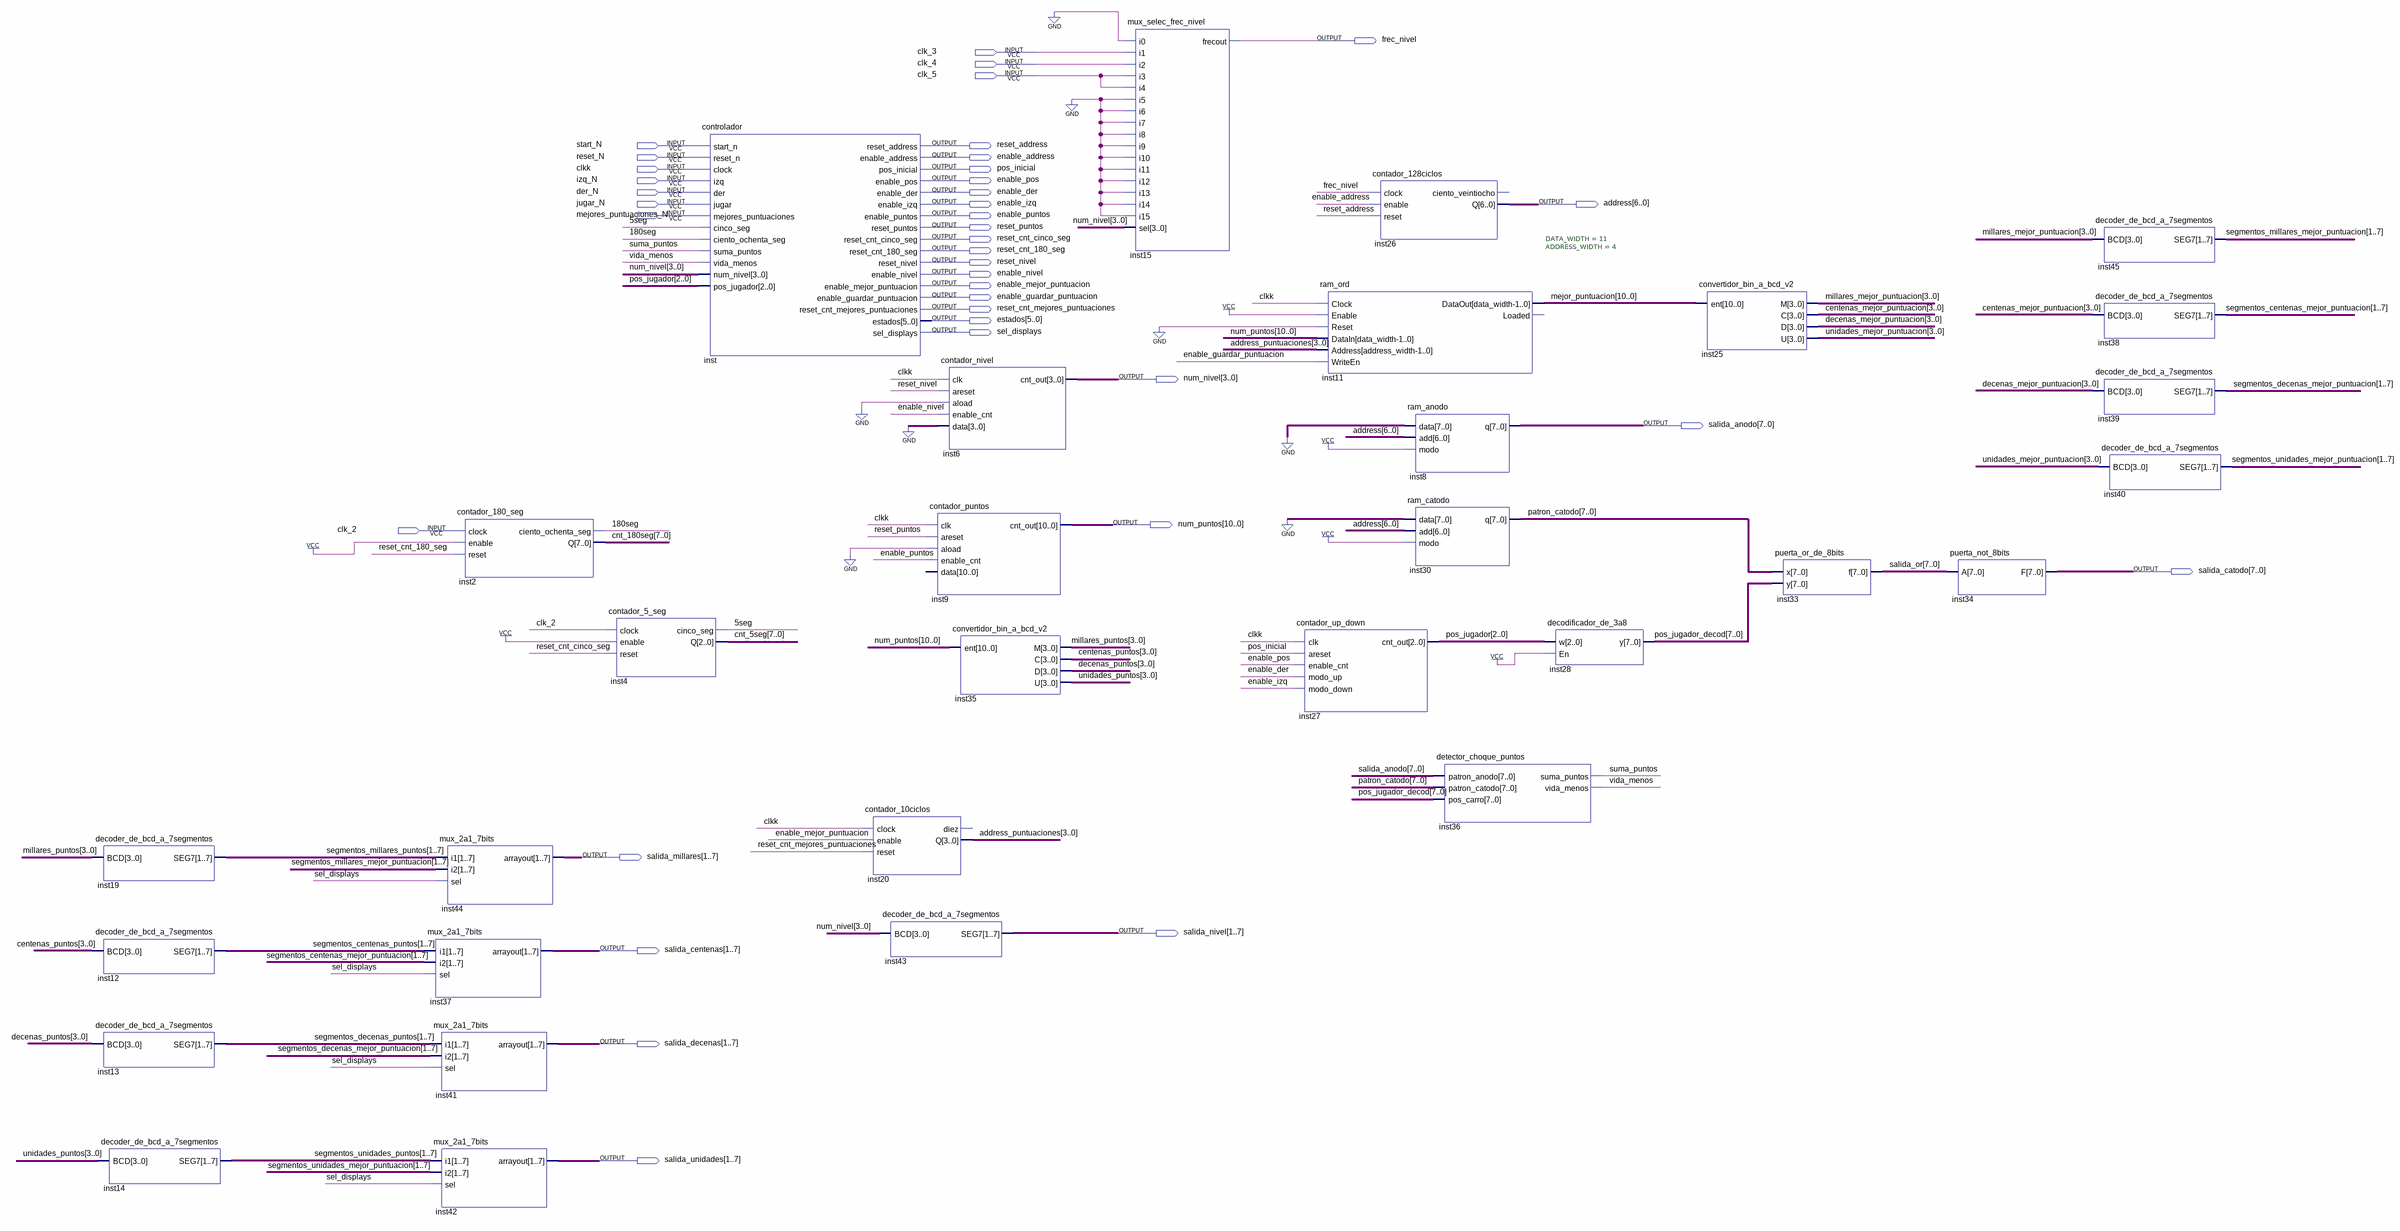
[diagram p0: schematic sheet]
// Quartus schematic simulate.bdf as structural Verilog: 31 symbols, 39 pins
module simulate (
  input  clk_3,
  input  clk_4,
  input  clk_5,
  input  start_N,
  input  reset_N,
  input  clkk,
  input  izq_N,
  input  der_N,
  input  jugar_N,
  input  mejores_puntuaciones_N,
  input  clk_2,
  output frec_nivel,
  output reset_address,
  output enable_address,
  output pos_inicial,
  output enable_pos,
  output enable_der,
  output enable_izq,
  output [6:0] address,
  output enable_puntos,
  output reset_puntos,
  output reset_cnt_cinco_seg,
  output reset_cnt_180_seg,
  output reset_nivel,
  output enable_nivel,
  output enable_mejor_puntuacion,
  output enable_guardar_puntuacion,
  output reset_cnt_mejores_puntuaciones,
  output [5:0] estados,
  output sel_displays,
  output [3:0] num_nivel,
  output [7:0] salida_anodo,
  output [10:0] num_puntos,
  output [7:0] salida_catodo,
  output [1:7] salida_millares,
  output [1:7] salida_nivel,
  output [1:7] salida_centenas,
  output [1:7] salida_decenas,
  output [1:7] salida_unidades
);

  wire \5seg , \180seg , suma_puntos, vida_menos;
  wire [2:0] pos_jugador;
  wire [3:0] address_puntuaciones, centenas_mejor_puntuacion, centenas_puntos, decenas_mejor_puntuacion,
       decenas_puntos, millares_mejor_puntuacion, millares_puntos, unidades_mejor_puntuacion, unidades_puntos;
  wire [7:0] cnt_5seg, cnt_180seg, patron_catodo, pos_jugador_decod, salida_or;
  wire [7:1] segmentos_centenas_mejor_puntuacion, segmentos_centenas_puntos,
       segmentos_decenas_mejor_puntuacion, segmentos_decenas_puntos, segmentos_millares_mejor_puntuacion,
       segmentos_millares_puntos, segmentos_unidades_mejor_puntuacion, segmentos_unidades_puntos;
  wire [10:0] mejor_puntuacion;

  decoder_de_bcd_a_7segmentos inst19 (
    .BCD(millares_puntos),
    .SEG7({segmentos_millares_puntos[1], segmentos_millares_puntos[2], segmentos_millares_puntos[3], segmentos_millares_puntos[4], segmentos_millares_puntos[5], segmentos_millares_puntos[6], segmentos_millares_puntos[7]}));
  decoder_de_bcd_a_7segmentos inst12 (
    .BCD(centenas_puntos),
    .SEG7({segmentos_centenas_puntos[1], segmentos_centenas_puntos[2], segmentos_centenas_puntos[3], segmentos_centenas_puntos[4], segmentos_centenas_puntos[5], segmentos_centenas_puntos[6], segmentos_centenas_puntos[7]}));
  decoder_de_bcd_a_7segmentos inst13 (
    .BCD(decenas_puntos),
    .SEG7({segmentos_decenas_puntos[1], segmentos_decenas_puntos[2], segmentos_decenas_puntos[3], segmentos_decenas_puntos[4], segmentos_decenas_puntos[5], segmentos_decenas_puntos[6], segmentos_decenas_puntos[7]}));
  decoder_de_bcd_a_7segmentos inst14 (
    .BCD(unidades_puntos),
    .SEG7({segmentos_unidades_puntos[1], segmentos_unidades_puntos[2], segmentos_unidades_puntos[3], segmentos_unidades_puntos[4], segmentos_unidades_puntos[5], segmentos_unidades_puntos[6], segmentos_unidades_puntos[7]}));
  mux_2a1_7bits inst44 (
    .i1({segmentos_millares_puntos[1], segmentos_millares_puntos[2], segmentos_millares_puntos[3], segmentos_millares_puntos[4], segmentos_millares_puntos[5], segmentos_millares_puntos[6], segmentos_millares_puntos[7]}),
    .i2({segmentos_millares_mejor_puntuacion[1], segmentos_millares_mejor_puntuacion[2], segmentos_millares_mejor_puntuacion[3], segmentos_millares_mejor_puntuacion[4], segmentos_millares_mejor_puntuacion[5], segmentos_millares_mejor_puntuacion[6], segmentos_millares_mejor_puntuacion[7]}),
    .sel(sel_displays), .arrayout(salida_millares));
  mux_2a1_7bits inst37 (
    .i1({segmentos_centenas_puntos[1], segmentos_centenas_puntos[2], segmentos_centenas_puntos[3], segmentos_centenas_puntos[4], segmentos_centenas_puntos[5], segmentos_centenas_puntos[6], segmentos_centenas_puntos[7]}),
    .i2({segmentos_centenas_mejor_puntuacion[1], segmentos_centenas_mejor_puntuacion[2], segmentos_centenas_mejor_puntuacion[3], segmentos_centenas_mejor_puntuacion[4], segmentos_centenas_mejor_puntuacion[5], segmentos_centenas_mejor_puntuacion[6], segmentos_centenas_mejor_puntuacion[7]}),
    .sel(sel_displays), .arrayout(salida_centenas));
  mux_2a1_7bits inst41 (
    .i1({segmentos_decenas_puntos[1], segmentos_decenas_puntos[2], segmentos_decenas_puntos[3], segmentos_decenas_puntos[4], segmentos_decenas_puntos[5], segmentos_decenas_puntos[6], segmentos_decenas_puntos[7]}),
    .i2({segmentos_decenas_mejor_puntuacion[1], segmentos_decenas_mejor_puntuacion[2], segmentos_decenas_mejor_puntuacion[3], segmentos_decenas_mejor_puntuacion[4], segmentos_decenas_mejor_puntuacion[5], segmentos_decenas_mejor_puntuacion[6], segmentos_decenas_mejor_puntuacion[7]}),
    .sel(sel_displays), .arrayout(salida_decenas));
  mux_2a1_7bits inst42 (
    .i1({segmentos_unidades_puntos[1], segmentos_unidades_puntos[2], segmentos_unidades_puntos[3], segmentos_unidades_puntos[4], segmentos_unidades_puntos[5], segmentos_unidades_puntos[6], segmentos_unidades_puntos[7]}),
    .i2({segmentos_unidades_mejor_puntuacion[1], segmentos_unidades_mejor_puntuacion[2], segmentos_unidades_mejor_puntuacion[3], segmentos_unidades_mejor_puntuacion[4], segmentos_unidades_mejor_puntuacion[5], segmentos_unidades_mejor_puntuacion[6], segmentos_unidades_mejor_puntuacion[7]}),
    .sel(sel_displays), .arrayout(salida_unidades));
  contador_180_seg inst2 (
    .enable(1'b1), .reset(reset_cnt_180_seg), .ciento_ochenta_seg(\180seg ), .Q(cnt_180seg));  // open: clock
  contador_5_seg inst4 (.clock(clk_2), .enable(1'b1), .reset(reset_cnt_cinco_seg), .cinco_seg(\5seg ), .Q(cnt_5seg));
  controlador inst (
    .start_n(start_N), .reset_n(reset_N), .clock(clkk), .izq(izq_N), .der(der_N), .jugar(jugar_N),
    .mejores_puntuaciones(mejores_puntuaciones_N), .cinco_seg(\5seg ), .ciento_ochenta_seg(\180seg ),
    .suma_puntos(suma_puntos), .vida_menos(vida_menos), .num_nivel(num_nivel), .pos_jugador(pos_jugador),
    .reset_address(reset_address), .enable_address(enable_address), .pos_inicial(pos_inicial),
    .enable_pos(enable_pos), .enable_der(enable_der), .enable_izq(enable_izq), .enable_puntos(enable_puntos),
    .reset_puntos(reset_puntos), .reset_cnt_cinco_seg(reset_cnt_cinco_seg),
    .reset_cnt_180_seg(reset_cnt_180_seg), .reset_nivel(reset_nivel), .enable_nivel(enable_nivel),
    .enable_mejor_puntuacion(enable_mejor_puntuacion), .enable_guardar_puntuacion(enable_guardar_puntuacion),
    .reset_cnt_mejores_puntuaciones(reset_cnt_mejores_puntuaciones), .estados(estados),
    .sel_displays(sel_displays));
  contador_10ciclos inst20 (
    .clock(clkk), .enable(enable_mejor_puntuacion), .reset(reset_cnt_mejores_puntuaciones),
    .Q(address_puntuaciones));  // open: diez
  decoder_de_bcd_a_7segmentos inst43 (.BCD(num_nivel), .SEG7(salida_nivel));
  contador_nivel inst6 (
    .clk(clkk), .areset(reset_nivel), .aload(1'b0), .enable_cnt(enable_nivel), .data(4'b0000),
    .cnt_out(num_nivel));
  contador_puntos inst9 (
    .clk(clkk), .areset(reset_puntos), .aload(1'b0), .enable_cnt(enable_puntos), .cnt_out(num_puntos));  // open: data
  convertidor_bin_a_bcd_v2 inst35 (
    .ent(num_puntos), .M(millares_puntos), .C(centenas_puntos), .D(decenas_puntos), .U(unidades_puntos));
  mux_selec_frec_nivel inst15 (
    .i0(1'b0), .i1(clk_3), .i2(clk_4), .i3(clk_5), .i4(clk_5), .i5(1'b0), .i6(1'b0), .i7(1'b0), .i8(1'b0),
    .i9(1'b0), .i10(1'b0), .i11(1'b0), .i12(1'b0), .i13(1'b0), .i14(1'b0), .i15(1'b0), .sel(num_nivel),
    .frecout(frec_nivel));
  ram_ord #(.DATA_WIDTH(11), .ADDRESS_WIDTH(4)) inst11 (
    .Clock(clkk), .Enable(1'b1), .Reset(1'b0), .DataIn(num_puntos), .Address(address_puntuaciones),
    .WriteEn(enable_guardar_puntuacion), .DataOut(mejor_puntuacion));  // open: Loaded
  contador_up_down inst27 (
    .clk(clkk), .areset(pos_inicial), .enable_cnt(enable_pos), .modo_up(enable_der), .modo_down(enable_izq),
    .cnt_out(pos_jugador));
  contador_128ciclos inst26 (
    .clock(frec_nivel), .enable(enable_address), .reset(reset_address), .Q(address));  // open: ciento_veintiocho
  ram_anodo inst8 (.data({8{1'b0}}), .add(address), .modo(1'b1), .q(salida_anodo));
  ram_catodo inst30 (.data({8{1'b0}}), .add(address), .modo(1'b1), .q(patron_catodo));
  detector_choque_puntos inst36 (
    .patron_anodo(salida_anodo), .patron_catodo(patron_catodo), .pos_carro(pos_jugador_decod),
    .suma_puntos(suma_puntos), .vida_menos(vida_menos));
  decodificador_de_3a8 inst28 (.w(pos_jugador), .En(1'b1), .y(pos_jugador_decod));
  convertidor_bin_a_bcd_v2 inst25 (
    .ent(mejor_puntuacion), .M(millares_mejor_puntuacion), .C(centenas_mejor_puntuacion),
    .D(decenas_mejor_puntuacion), .U(unidades_mejor_puntuacion));
  puerta_or_de_8bits inst33 (.x(patron_catodo), .y(pos_jugador_decod), .f(salida_or));
  puerta_not_8bits inst34 (.A(salida_or), .F(salida_catodo));
  decoder_de_bcd_a_7segmentos inst45 (
    .BCD(millares_mejor_puntuacion),
    .SEG7({segmentos_millares_mejor_puntuacion[1], segmentos_millares_mejor_puntuacion[2], segmentos_millares_mejor_puntuacion[3], segmentos_millares_mejor_puntuacion[4], segmentos_millares_mejor_puntuacion[5], segmentos_millares_mejor_puntuacion[6], segmentos_millares_mejor_puntuacion[7]}));
  decoder_de_bcd_a_7segmentos inst38 (
    .BCD(centenas_mejor_puntuacion),
    .SEG7({segmentos_centenas_mejor_puntuacion[1], segmentos_centenas_mejor_puntuacion[2], segmentos_centenas_mejor_puntuacion[3], segmentos_centenas_mejor_puntuacion[4], segmentos_centenas_mejor_puntuacion[5], segmentos_centenas_mejor_puntuacion[6], segmentos_centenas_mejor_puntuacion[7]}));
  decoder_de_bcd_a_7segmentos inst39 (
    .BCD(decenas_mejor_puntuacion),
    .SEG7({segmentos_decenas_mejor_puntuacion[1], segmentos_decenas_mejor_puntuacion[2], segmentos_decenas_mejor_puntuacion[3], segmentos_decenas_mejor_puntuacion[4], segmentos_decenas_mejor_puntuacion[5], segmentos_decenas_mejor_puntuacion[6], segmentos_decenas_mejor_puntuacion[7]}));
  decoder_de_bcd_a_7segmentos inst40 (
    .BCD(unidades_mejor_puntuacion),
    .SEG7({segmentos_unidades_mejor_puntuacion[1], segmentos_unidades_mejor_puntuacion[2], segmentos_unidades_mejor_puntuacion[3], segmentos_unidades_mejor_puntuacion[4], segmentos_unidades_mejor_puntuacion[5], segmentos_unidades_mejor_puntuacion[6], segmentos_unidades_mejor_puntuacion[7]}));
endmodule
